# Altium schematic sheet Top.SchDoc
size A3
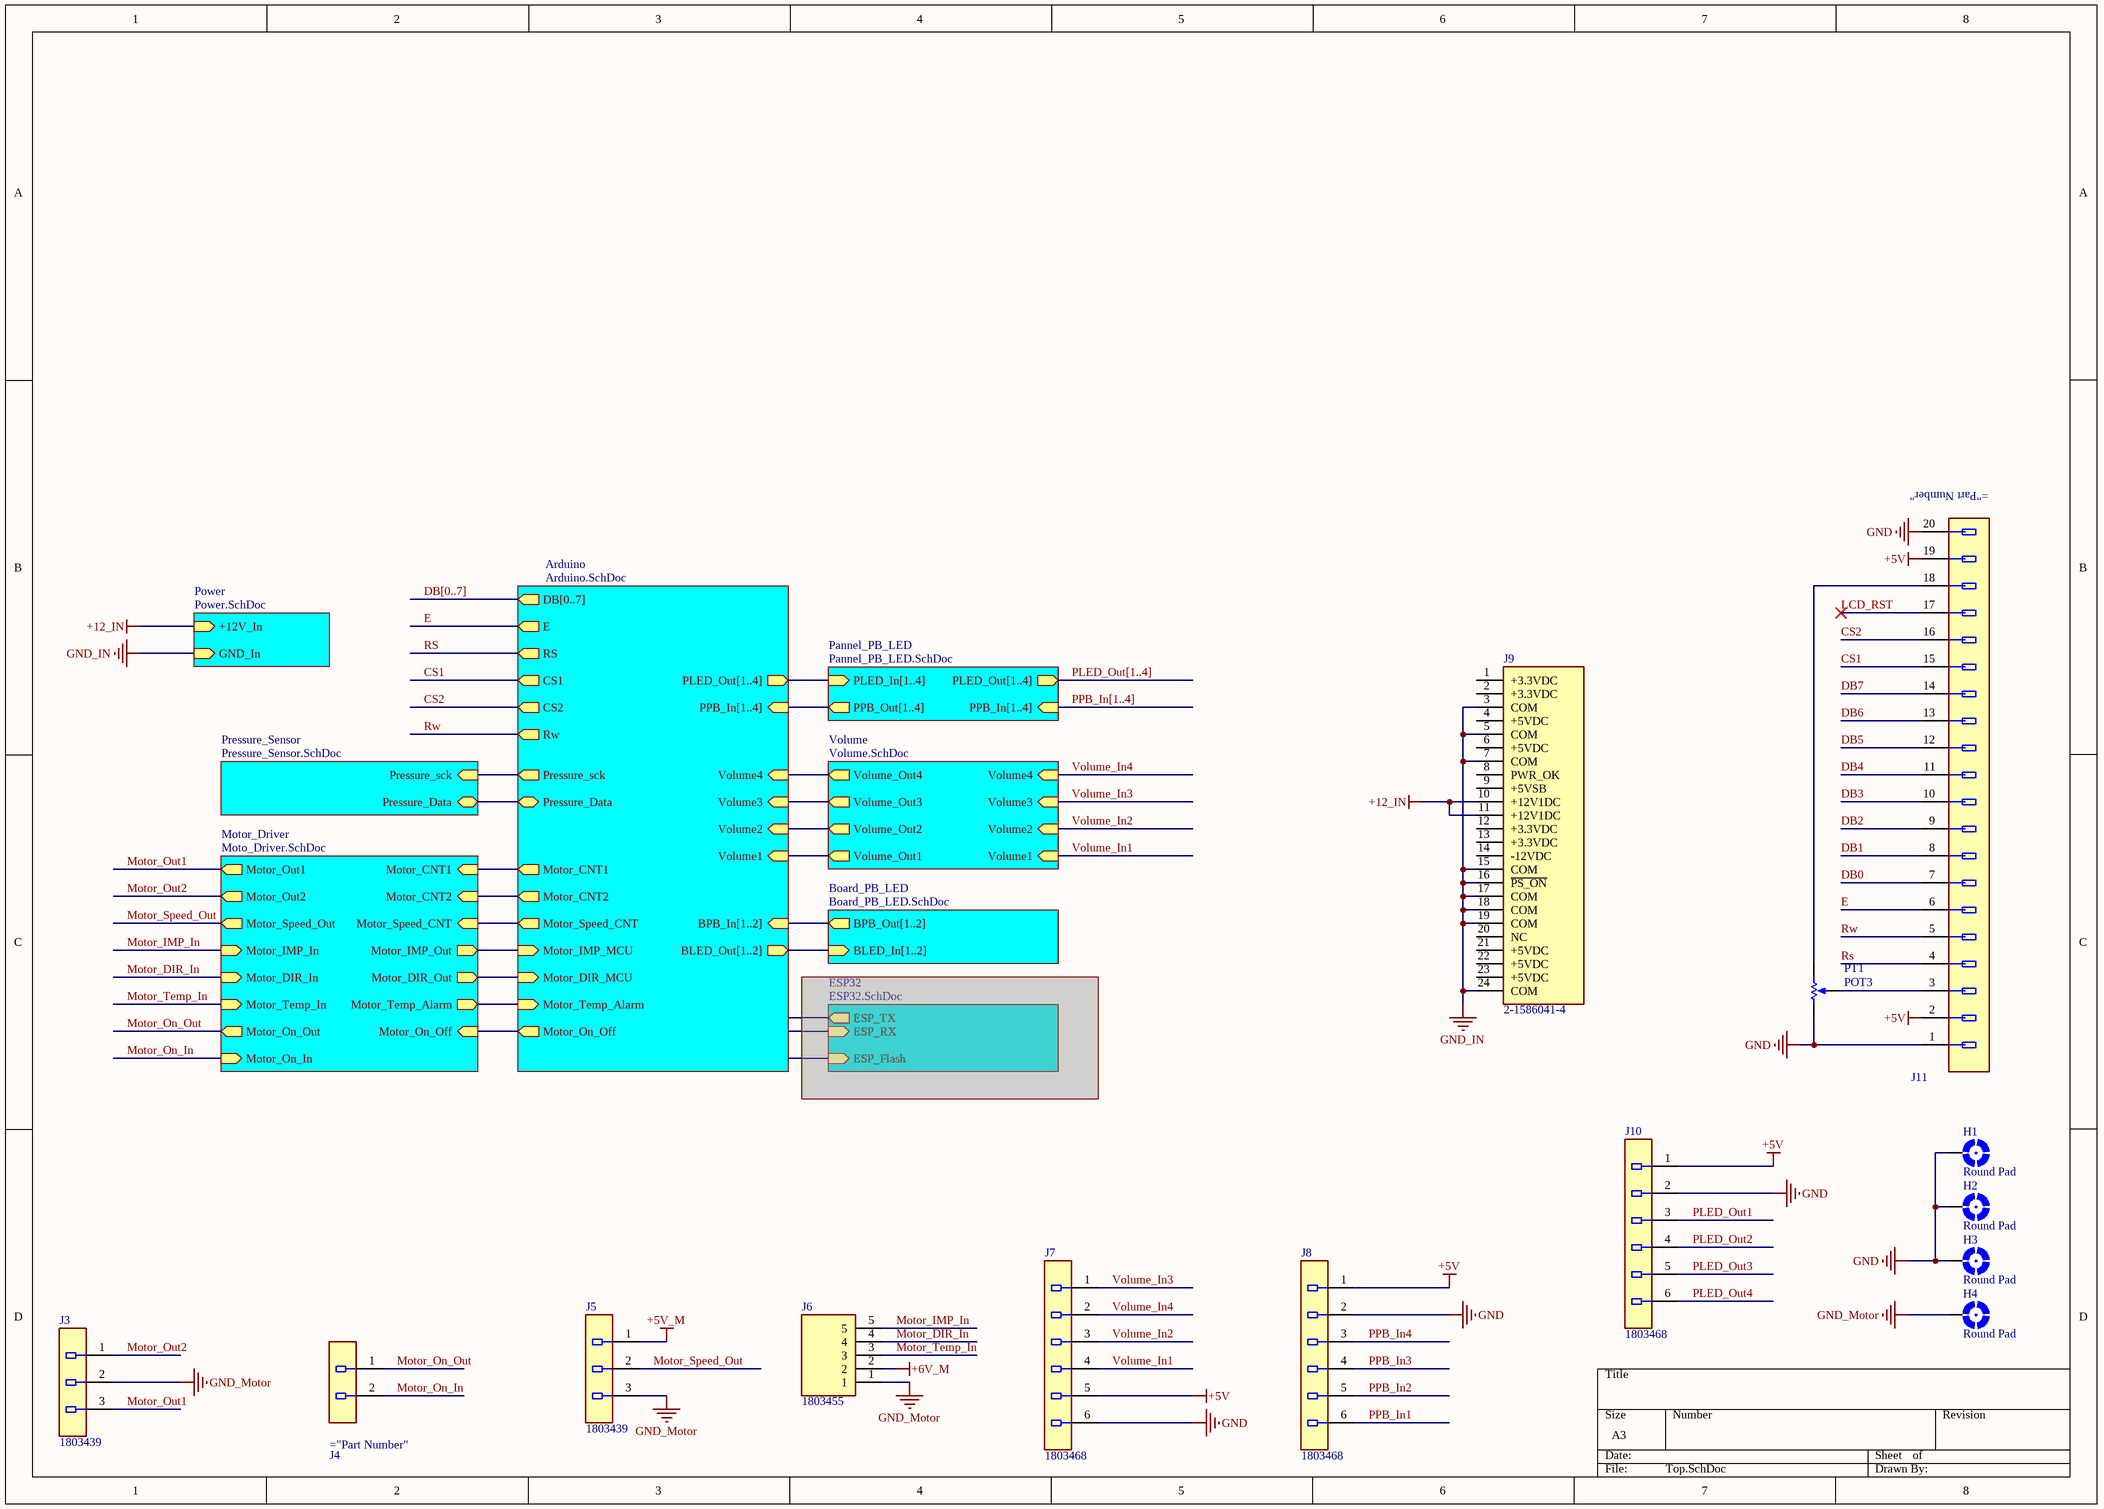
[diagram p0: Top.SchDoc]

## Parts
H1  Round Pad  [P3.0C]  (no BOM)
H2  Round Pad  [P3.0C]  (no BOM)
H3  Round Pad  [P3.0C]  (no BOM)
H4  Round Pad  [P3.0C]  (no BOM)
J3  Part Number: 1803439  [Phoenix_Contact_1803439_0]  (hidden comment: Conn_Phoenix_Contact_1803439_eec)
J4  1843606  [Phoenix_Contact_1843606_MFG]  (value not drawn)
J5  Part Number: 1803439  [Phoenix_Contact_1803439_0]  (hidden comment: Conn_Phoenix_Contact_1803439_eec)
J6  1803455  [SHDR5W100P0X381_1X5_2044X725X920P]
J7  Part Number: 1803468  [Phoenix_Contact_1803468_0]  (hidden comment: Conn_Phoenix_Contact_1803468_eec)
J8  Part Number: 1803468  [Phoenix_Contact_1803468_0]  (hidden comment: Conn_Phoenix_Contact_1803468_eec)
J9  2-1586041-4  [Molex24Pin - Vertical]
J10  Part Number: 1803468  [Phoenix_Contact_1803468_0]  (hidden comment: Conn_Phoenix_Contact_1803468_eec)
J11  TSS-110-01-G-D  [Samtec_Inc._http--suddendocs.samtec.com-prints-tss-tstd.pdf_0]  (value not drawn)
PT1  POT3  [POT3]

## Sub-sheets
Arduino = Arduino.SchDoc: DB[0..7] (out), PLED_Out[1..4] (out), Motor_Temp_Alarm (in), Motor_Speed_CNT (out), Motor_DIR_MCU (in), Volume1 (in), PPB_In[1..4] (in), BPB_In[1..2] (in), Motor_CNT2 (out), Volume3 (in), Motor_CNT1 (out), Pressure_Data (bidir), Motor_On_Off (out), E (out), Volume2 (in), CS2 (out), Volume4 (in), Rw (out), CS1 (out), RS (out), Pressure_sck (out), BLED_Out[1..2] (out), Motor_IMP_MCU (in)
Board_PB_LED = Board_PB_LED.SchDoc: BPB_Out[1..2] (out), BLED_In[1..2] (in)
ESP32 = ESP32.SchDoc (masked out): ESP_TX (out), ESP_RX (in), ESP_Flash (in)
Motor_Driver = Moto_Driver.SchDoc: Motor_Out1 (out), Motor_CNT1 (in), Motor_CNT2 (in), Motor_Out2 (out), Motor_Speed_CNT (in), Motor_Speed_Out (out), Motor_IMP_Out (out), Motor_On_Out (out), Motor_On_Off (in), Motor_Temp_Alarm (out), Motor_DIR_In (in), Motor_Temp_In (in), Motor_IMP_In (in), Motor_DIR_Out (out), Motor_On_In (in)
Pannel_PB_LED = Pannel_PB_LED.SchDoc: PLED_In[1..4] (in), PLED_Out[1..4] (out), PPB_Out[1..4] (out), PPB_In[1..4] (in)
Power = Power.SchDoc: +12V_In (in), GND_In (in)
Pressure_Sensor = Pressure_Sensor.SchDoc: Pressure_sck (in), Pressure_Data (bidir)
Volume = Volume.SchDoc: Volume_Out3 (out), Volume3 (in), Volume_Out1 (out), Volume2 (in), Volume1 (in), Volume_Out4 (out), Volume_Out2 (out), Volume4 (in)

## Nets
+5V: J7.5 J8.1 J10.1 J11.2 J11.19
+5V_M: J5.1
+6V_M: J6.2
+12_IN: J9.10(+12V1DC) J9.11(+12V1DC) ; sheet Power/+12V_In
GND: H1.P H2.P H3.P H4.P J3.2 J5.3 J6.1 J7.6 J8.2 J10.2 J11.1 J11.20 PT1.1(TOP)  [also labelled GND_Motor, SHIELD]
GND_IN: J9.3(COM) J9.5(COM) J9.7(COM) J9.15(COM) J9.16(~{PS_ON}) J9.17(COM) J9.18(COM) J9.19(COM) J9.24(COM) ; sheet Power/GND_In
CS1: J11.15 ; sheet Arduino/CS1
CS2: J11.16 ; sheet Arduino/CS2
DB0: J11.7
DB1: J11.8
DB2: J11.9
DB3: J11.10
DB4: J11.11
DB5: J11.12
DB6: J11.13
DB7: J11.14
E: J11.6 ; sheet Arduino/E
LCD_RST: J11.17
Motor_DIR_In: J6.4 ; sheet Motor_Driver/Motor_DIR_In
Motor_IMP_In: J6.5 ; sheet Motor_Driver/Motor_IMP_In
Motor_On_In: J4.2 ; sheet Motor_Driver/Motor_On_In
Motor_On_Out: J4.1 ; sheet Motor_Driver/Motor_On_Out
Motor_Out1: J3.3 ; sheet Motor_Driver/Motor_Out1
Motor_Out2: J3.1 ; sheet Motor_Driver/Motor_Out2
Motor_Speed_Out: J5.2 ; sheet Motor_Driver/Motor_Speed_Out
Motor_Temp_In: J6.3 ; sheet Motor_Driver/Motor_Temp_In
PLED_Out1: J10.3
PLED_Out2: J10.4
PLED_Out3: J10.5
PLED_Out4: J10.6
PPB_In1: J8.6
PPB_In2: J8.5
PPB_In3: J8.4
PPB_In4: J8.3
Rs: J11.4 ; sheet Arduino/RS
Rw: J11.5 ; sheet Arduino/Rw
Volume_In1: J7.4 ; sheet Volume/Volume1
Volume_In2: J7.3 ; sheet Volume/Volume2
Volume_In3: J7.1 ; sheet Volume/Volume3
Volume_In4: J7.2 ; sheet Volume/Volume4
NetJ11_3: J11.3 PT1.3(TAP)
NetJ11_18: J11.18 PT1.2(BOT)
(unnamed): sheet Arduino/Motor_Temp_Alarm, sheet Motor_Driver/Motor_Temp_Alarm
(unnamed): sheet Arduino/Motor_Speed_CNT, sheet Motor_Driver/Motor_Speed_CNT
(unnamed): sheet Arduino/Motor_DIR_MCU, sheet Motor_Driver/Motor_DIR_Out
(unnamed): sheet Arduino/Volume1, sheet Volume/Volume_Out1
(unnamed): sheet Arduino/Motor_CNT2, sheet Motor_Driver/Motor_CNT2
(unnamed): sheet Arduino/Volume3, sheet Volume/Volume_Out3
(unnamed): sheet Arduino/Motor_CNT1, sheet Motor_Driver/Motor_CNT1
(unnamed): sheet Arduino/Pressure_Data, sheet Pressure_Sensor/Pressure_Data
(unnamed): sheet Arduino/Motor_On_Off, sheet Motor_Driver/Motor_On_Off
(unnamed): sheet Arduino/Volume2, sheet Volume/Volume_Out2
(unnamed): sheet Arduino/Volume4, sheet Volume/Volume_Out4
(unnamed): sheet Arduino/Pressure_sck, sheet Pressure_Sensor/Pressure_sck
(unnamed): sheet Arduino/Motor_IMP_MCU, sheet Motor_Driver/Motor_IMP_Out

Not connected (* = marked no-connect by the designer): J9 1(+3.3VDC) 2(+3.3VDC) 4(+5VDC) 6(+5VDC) 8(PWR_OK) 9(+5VSB) 12(+3.3VDC) 13(+3.3VDC) 14(-12VDC) 20(NC) 21(+5VDC) 22(+5VDC) 23(+5VDC)

## Buses and harness runs
bus DB[0..7] = sheet Arduino/DB[0..7]
bus PLED_Out[1..4] = sheet Pannel_PB_LED/PLED_Out[1..4]
bus PPB_In[1..4] = sheet Pannel_PB_LED/PPB_In[1..4]
bus sheet Arduino/BLED_Out[1..2] = sheet Board_PB_LED/BLED_In[1..2]
bus sheet Arduino/BPB_In[1..2] = sheet Board_PB_LED/BPB_Out[1..2]
bus sheet Arduino/PLED_Out[1..4] = sheet Pannel_PB_LED/PLED_In[1..4]
bus sheet Arduino/PPB_In[1..4] = sheet Pannel_PB_LED/PPB_Out[1..4]

## Library data of the parts
H1-H4 = MOUNT-PAD-ROUND: MOUNTING PAD, round
J3 J5 = Conn_Phoenix_Contact_1803439_eec: CONN 3 Position Terminal Block Header, Male Pins, Shrouded (4 Side) 0.150" (3.81mm) Vertical Through Hole; Manufacturer: Phoenix Contact; Current: 8A; Number of Positions: 3; Voltage - UL: 300V; Voltage - IEC: 250V; helpURL: https://upverter.com/upn/revision/15cf6a4194e13e43/; ComponentLink2Description: Datasheet; Temperature: to; Package: HDR03; Supplier 2: Mouser; Price: 1.01681353673; Supplier 1: Digi-Key; ComponentLink1URL: https://upverter.com/upn/revision/15cf6a4194e13e43/; Supplier Part Number 2: 651-1803439; Supplier Part Number 1: 277-1222-ND; ComponentLink1Description: Upverter; ComponentLink2URL: https://www.phoenixcontact.com/online/portal/ca/pxc/product_detail_page/!ut/p/b1/3ZfJjqNIEIafpR6AdrKbI_tmMDuGCwKM2YzBYNanH1epNYcZVdel5YPJEyjEry8y4s-MXbgLYHi_J3CCQPDdaRfe4qnM40fZ3uLr53tIRJSoEwDBCBgIJg5oBjEVUnUIEkF3_u4EsMiu1k492It-sDHlbi8yHOwHVesM1QUjMDMVR8xGsF3fyzpJKbMGb3m-ldRMvdytogjEpUzEa8lZ9WDWMrMfblh9r_G9jx23obf2YSs-2rv4yBnWYYhKP6Qt7R-f_-vW1r0u1lUoq1adcqJY64DoyrtY5gFB9r04PgKRloXATq5-UXB1rJW0WkCjM3884YLv4SwL_MQePAPIbwNofOfsTp4LH7hWnnkOOTArw_XmlI6IdJtrNOQymFamkLNrkZpsxL5rt4NN4RNT9W1XVFr7OAp8r54RYI96zPDufnQMXusajRdMglVtvbrxB4zkJlzcIkvpNmZLT-GVaR_QSeLSBU_I0uAFuzTwPpZg6WzD_F29V3iNVlF0sagDr-69_VydVgaLOBF44TK1Hz-BkW8KZmLvCka8K9i79pj5rj1GvGuPEe_aY8S79pj2tqX4ruahwZ9gJzfSP8E4iSg7m86AZnOldR6lvtQQKldj0xZDx5ipFru0uAyccwdFJyLPVeUWkwuio7balMKGiIEYKou4Ojw-m_Ps-YOed7PU7bu5OO4viE1KIEZPaI6BhEwUT0bv8T26k0lT1IVnyIcTm9RCG5kMLqD80NZGu2IkhFs1DPIH3vnMPiuW1Jh8JiWNGUPCG-poAqyWAhworNYfeYPOlHW-eN3QQH1DreMULztlF5ZJ82tOm1_gV7ekv7q-PY_pIzpnj7i8Rl2cZztPSYeFHbSZ45NiQBxTbG5HO5QHKxGEuGeuICKFNYN7ZEQX7Hj0HuvFFArVRqcxrSpV8utyrCdYB1cMrmtbwBpc5O89Jx22CMvVCSNuOJBiU-BRyMIheo51xkUxYATodnThS4xTbmt-fDxHgPBPN-Wvi_RXAPjmocHOzm4RS0fGiWXpH4pART6L4PfQIW_1ZlVgBro7ILpbb2DzdK06-brDz7rO6A-OXgAPVsd57jPnPvcaA87jZJw9y2VoVqX1c_6TIPxqQfTFguyrBe1XpxQBrxb8-4Tf2sK1HB5fpjB8usL2ZY487eQhJJkBdFs9iq2mnJEoXkVCz7WhQg9okqAqD2tq0EBucCSmsKr8gKUv52hDkiplykueytOF0UzYoeUmPFqGQvNIxiYGMWE9QwxF4uZQ7MispJFQRRE-D0dNlWayA-7UBJNixy0hNw4I1cutopgdIKnHWISwCmAnJ1YYLpTDnfUsz-qpWJ7usHq7Nr53SY6H2_rpLLrUNtkPiZbx_yV6M2edpGen0mYYgE0jJVN_JlbXbdjmwQJ6T7MrddN5WHW45-mnS78TTYdLfpN_EiRfLMiDVwsiLxZ0X03own9d0N8Ff54O_D4b2rFPs511zi7xeH3szDROi-yQTdnV-DzTm7BfofiblYAK-8-XGd7_u6CA_vgHnVCNeg!!/dl4/d5/L2dBISEvZ0FBIS9nQSEh/pw/Z7_9GN6024610FQ50AB2QJ7KT6766/act/id=0/p=downloadId=2845392/p=action=downloadFile/349172715691/-/; RoHS: TRUE; Mouser Part Number: 651-1803439; Digikey Description: CONN 3 Position Terminal Block Header, Male Pins, Shrouded (4 Side) 0.150" (3.81mm) Vertical Through Hole; Digikey Part Number: 277-1222-ND; Lead Free: yes; Pitch: 3.81mm
J6 = 1803455: Connector; Manufacturer_Name: Phoenix Contact; Allied_Number: 70054558; Datasheet Link: http://uk.rs-online.com/web/p/products/2204866; Height: 9.2mm; Manufacturer_Part_Number: 1803455; Mouser Part Number: 651-1803455; Mouser Price/Stock: https://www.mouser.co.uk/ProductDetail/Phoenix-Contact/1803455?qs=ChwaSN6Xm4%252Bowd0eKzWfkQ%3D%3D; RS Part Number: 2204866; RS Price/Stock: http://uk.rs-online.com/web/p/products/2204866; Allied Price/Stock: http://www.alliedelec.com/phoenix-contact-1803455/70054558/
J7 J8 J10 = Conn_Phoenix_Contact_1803468_eec: CONN TERM BLOCK HDR 6POS VERT 3.81MM; Manufacturer: Phoenix Contact; helpURL: https://upverter.com/upn/revision/3db961df2b2b7a0d/; ComponentLink2Description: Datasheet; Temperature: to; Package: HDR6; Supplier 2: Mouser; Price: 1.88397784029; Supplier 1: Digi-Key; ComponentLink1URL: https://upverter.com/upn/revision/3db961df2b2b7a0d/; Supplier Part Number 2: 651-1803468; Supplier Part Number 1: 277-1225-ND; ComponentLink1Description: Upverter; ComponentLink2URL: http://media.digikey.com/pdf/Data%20Sheets/Phoenix%20Contact%20PDFs/1803468.pdf; RoHS: TRUE; Mouser Part Number: 651-1803468; Digikey Description: CONN TERM BLOCK HDR 6POS VERT 3.81MM; Digikey Part Number: 277-1225-ND; Lead Free: yes; Mounting Type: Through Hole
J9 = ATX Power Receptor: ATX main 24 PIN; MF: TE Connectivity; Value: *; TE_purchase_URL: https://www.te.com/usa-en/product-2-1586041-4.html?te_bu=Cor&te_type=disp&te_campaign=seda_glo_cor-seda-global-disp-prtnr-fy19-seda-model-bom-cta_sma-317_1&elqCampaignId=32493; Price: None; Package: None; SnapEDA_Link: https://www.snapeda.com/parts/2-1586041-4/TE%20Connectivity%20AMP%20Connectors/view-part/2469079/?ref=snap; Availability: Unavailable; MP: 2-1586041-4
PT1 = POT3: Variable Potentiometer top adjust; Designer: Seyed Mohsen Ghasemian; WEB: www.picpars.com